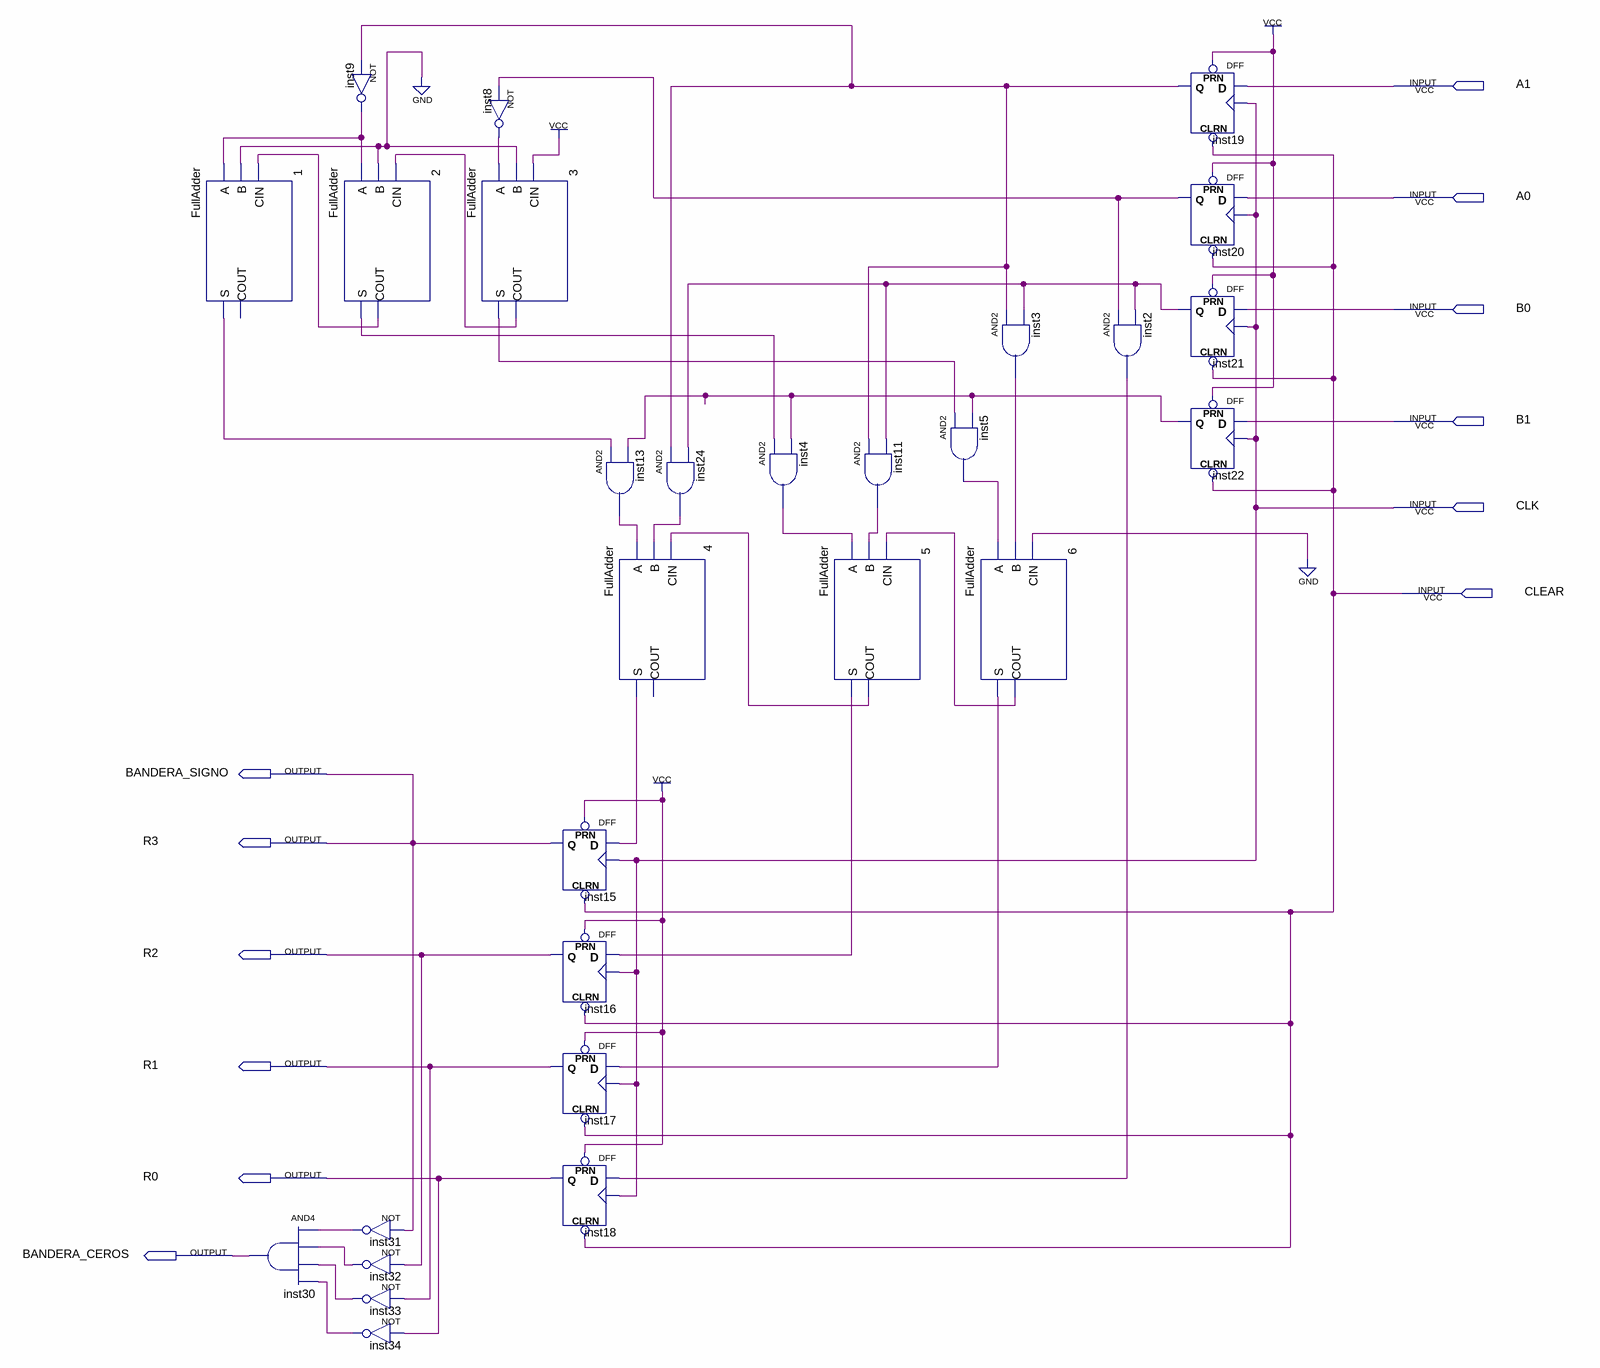
[diagram p0: schematic sheet]
// Quartus schematic mult2bitscs.bdf as structural Verilog: 28 symbols, 12 pins
module mult2bitscs (
  input  A1,
  input  A0,
  input  B0,
  input  B1,
  input  CLK,
  input  CLEAR,
  output BANDERA_SIGNO,
  output R3,
  output R2,
  output R1,
  output R0,
  output BANDERA_CEROS
);

  wire inst2_out, inst3_out, inst4_out, inst5_out, inst8_out, inst9_out, inst11_out, inst13_out, inst19_q,
       inst20_q, inst21_q, inst22_q, inst24_out, inst31_out, inst32_out, inst33_out, inst34_out, n1_s,
       n2_cout, n2_s, n3_cout, n3_s, n4_s, n5_cout, n5_s, n6_cout, n6_s;

  FullAdder u_1 (.A(inst9_out), .B(1'b0), .CIN(n2_cout), .S(n1_s));  // open: COUT
  and inst30 (BANDERA_CEROS, inst31_out, inst32_out, inst33_out, inst34_out);
  not inst9 (inst9_out, inst19_q);
  FullAdder u_2 (.A(inst9_out), .B(1'b0), .CIN(n3_cout), .S(n2_s), .COUT(n2_cout));
  not inst31 (inst31_out, BANDERA_SIGNO);
  not inst32 (inst32_out, R2);
  not inst33 (inst33_out, R1);
  not inst34 (inst34_out, R0);
  not inst8 (inst8_out, inst20_q);
  FullAdder u_3 (.A(inst8_out), .B(1'b0), .CIN(1'b1), .S(n3_s), .COUT(n3_cout));
  DFF inst15 (.CLRN(CLEAR), .CLK(CLK), .D(n4_s), .PRN(1'b1), .Q(BANDERA_SIGNO));
  DFF inst16 (.CLRN(CLEAR), .CLK(CLK), .D(n5_s), .PRN(1'b1), .Q(R2));
  DFF inst17 (.CLRN(CLEAR), .CLK(CLK), .D(n6_s), .PRN(1'b1), .Q(R1));
  DFF inst18 (.CLRN(CLEAR), .CLK(CLK), .D(inst2_out), .PRN(1'b1), .Q(R0));
  and inst13 (inst13_out, n1_s, inst22_q);
  FullAdder u_4 (.A(inst13_out), .B(inst24_out), .CIN(n5_cout), .S(n4_s));  // open: COUT
  and inst24 (inst24_out, inst19_q, inst21_q);
  and inst4 (inst4_out, n2_s, inst22_q);
  FullAdder u_5 (.A(inst4_out), .B(inst11_out), .CIN(n6_cout), .S(n5_s), .COUT(n5_cout));
  and inst11 (inst11_out, inst19_q, inst21_q);
  and inst5 (inst5_out, n3_s, inst22_q);
  FullAdder u_6 (.A(inst5_out), .B(inst3_out), .CIN(1'b0), .S(n6_s), .COUT(n6_cout));
  and inst3 (inst3_out, inst19_q, inst21_q);
  and inst2 (inst2_out, inst20_q, inst21_q);
  DFF inst19 (.CLRN(CLEAR), .CLK(CLK), .D(A1), .PRN(1'b1), .Q(inst19_q));
  DFF inst20 (.CLRN(CLEAR), .CLK(CLK), .D(A0), .PRN(1'b1), .Q(inst20_q));
  DFF inst21 (.CLRN(CLEAR), .CLK(CLK), .D(B0), .PRN(1'b1), .Q(inst21_q));
  DFF inst22 (.CLRN(CLEAR), .CLK(CLK), .D(B1), .PRN(1'b1), .Q(inst22_q));

  assign R3 = BANDERA_SIGNO;
endmodule
